# Altium schematic sheet 13_RFFE.SchDoc: RF front end
size A3; Organization: Lime Microsystems; Address1: Surrey Tech Centre; Address2: Guildford GU2 7YG; Address3: Surrey; Address4: United Kingdom; SheetNumber: 13
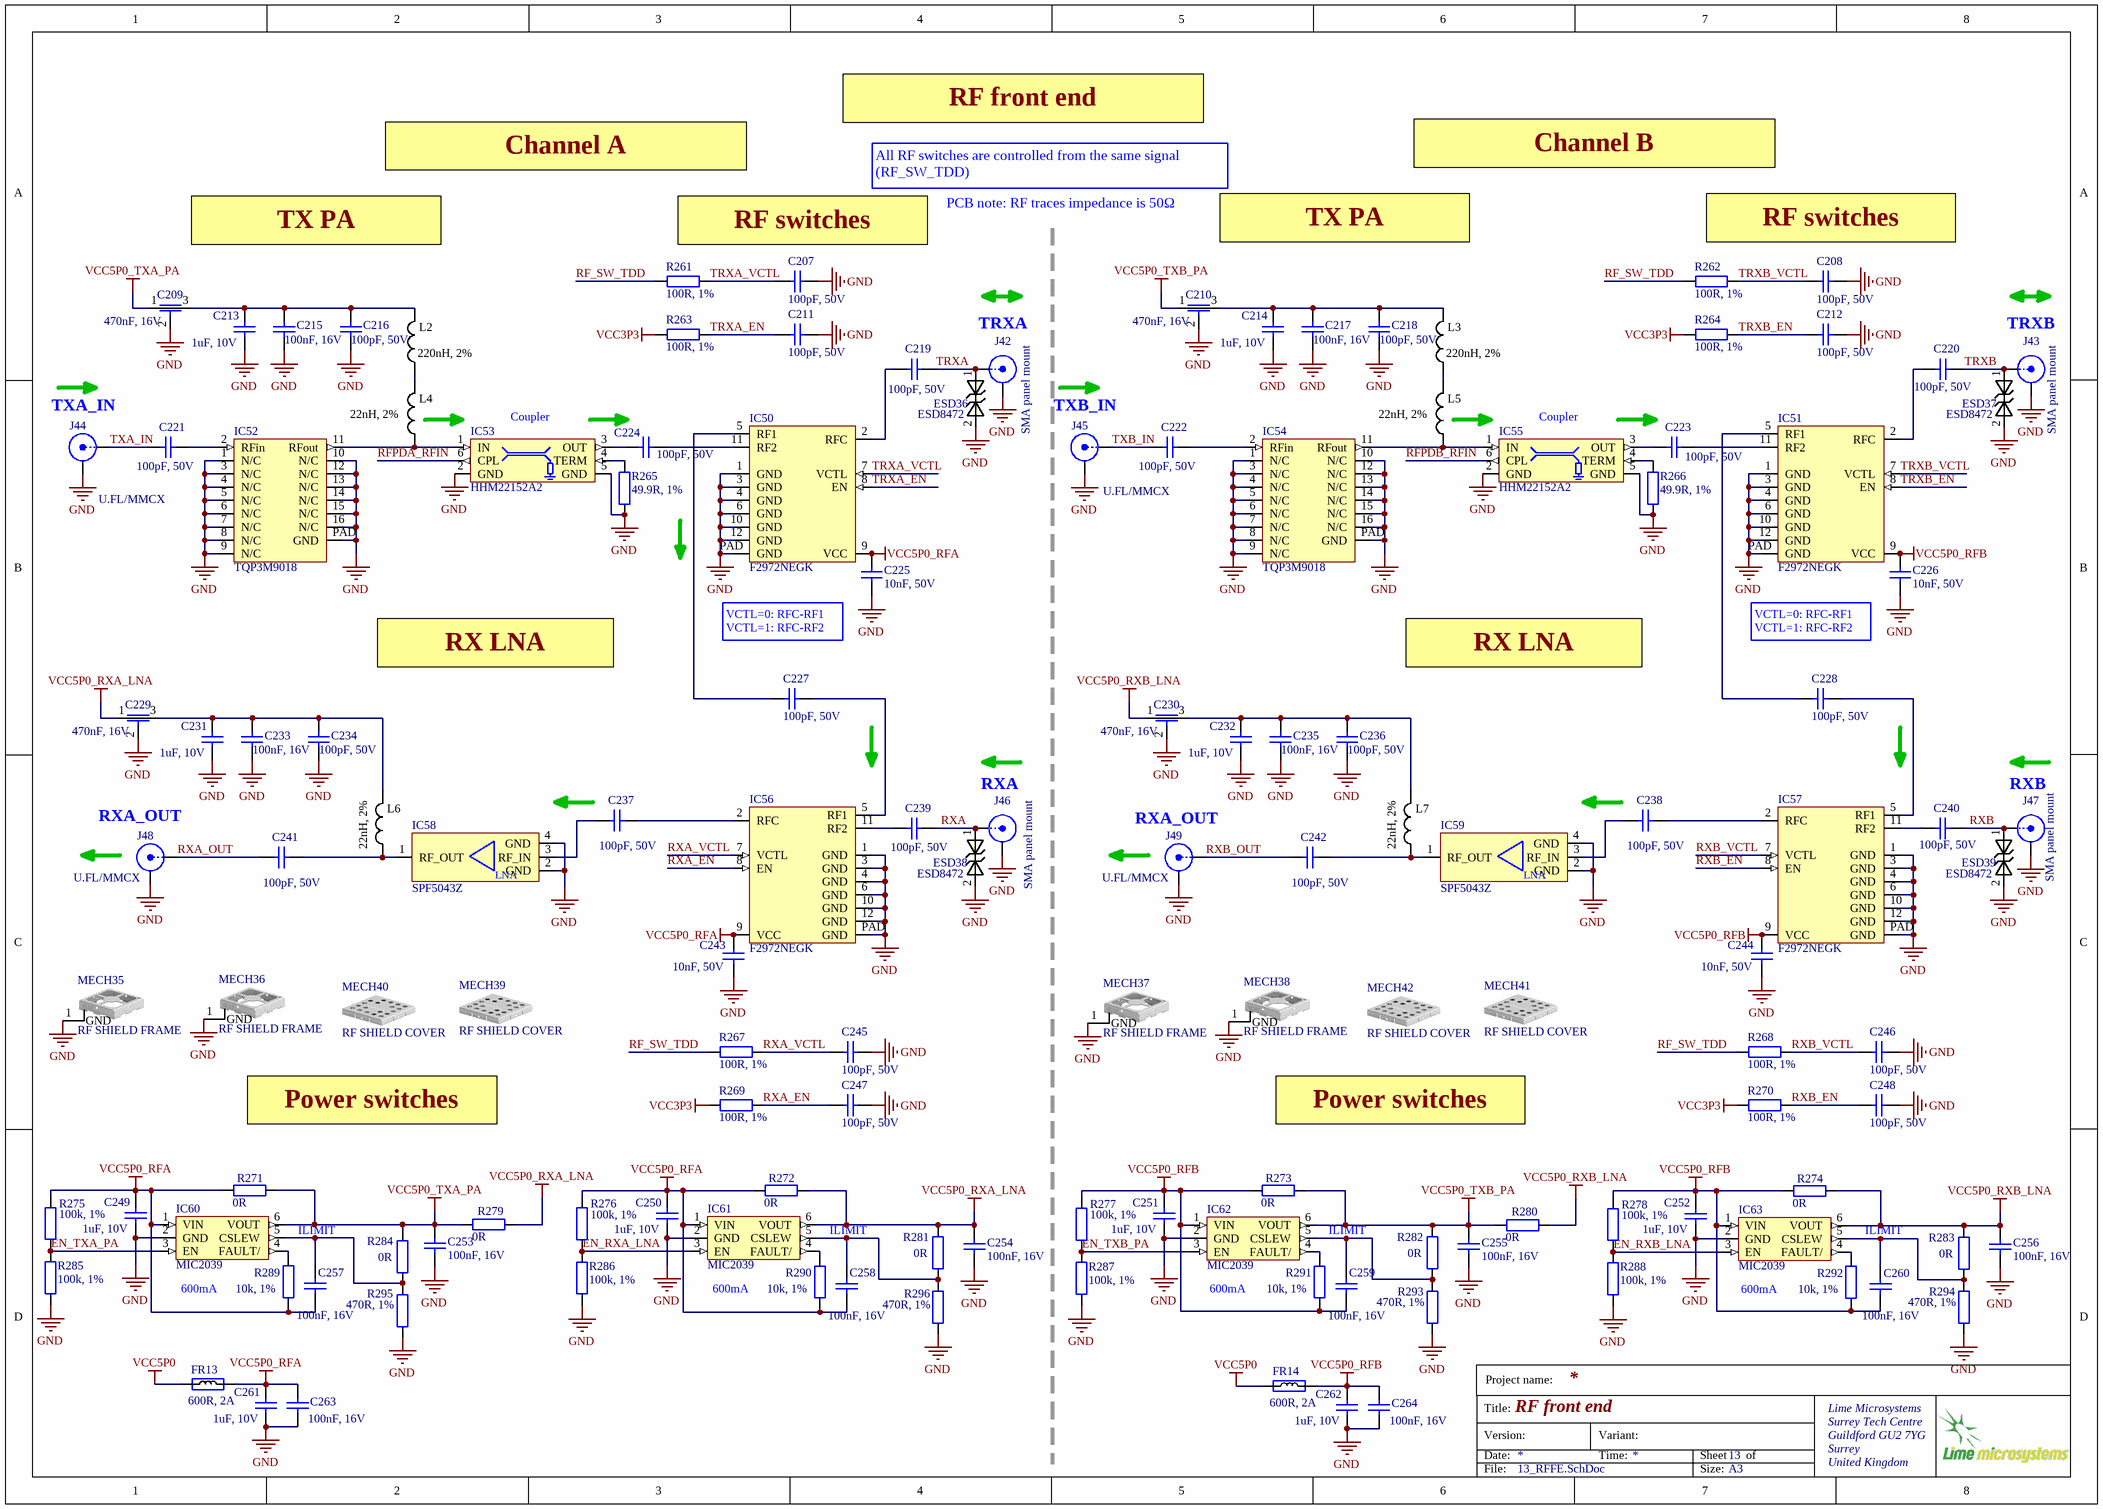
[diagram p0: 13_RFFE.SchDoc]

## Parts
C207  100pF, 50V  [CAP0402]
C208  100pF, 50V  [CAP0402]
C209  470nF, 16V  [CAP0805_FEEDTHROUGH]
C210  470nF, 16V  [CAP0805_FEEDTHROUGH]
C211  100pF, 50V  [CAP0402]
C212  100pF, 50V  [CAP0402]
C213  1uF, 10V  [CAP0402]
C214  1uF, 10V  [CAP0402]
C215  100nF, 16V  [CAP0402]
C216  100pF, 50V  [CAP0402]
C217  100nF, 16V  [CAP0402]
C218  100pF, 50V  [CAP0402]
C219  100pF, 50V  [CAP0402]
C220  100pF, 50V  [CAP0402]
C221  100pF, 50V  [CAP0402]
C222  100pF, 50V  [CAP0402]
C223  100pF, 50V  [CAP0402]
C224  100pF, 50V  [CAP0402]
C225  10nF, 50V  [CAP0402]
C226  10nF, 50V  [CAP0402]
C227  100pF, 50V  [CAP0402]
C228  100pF, 50V  [CAP0402]
C229  470nF, 16V  [CAP0805_FEEDTHROUGH]
C230  470nF, 16V  [CAP0805_FEEDTHROUGH]
C231  1uF, 10V  [CAP0402]
C232  1uF, 10V  [CAP0402]
C233  100nF, 16V  [CAP0402]
C234  100pF, 50V  [CAP0402]
C235  100nF, 16V  [CAP0402]
C236  100pF, 50V  [CAP0402]
C237  100pF, 50V  [CAP0402]
C238  100pF, 50V  [CAP0402]
C239  100pF, 50V  [CAP0402]
C240  100pF, 50V  [CAP0402]
C241  100pF, 50V  [CAP0402]
C242  100pF, 50V  [CAP0402]
C243  10nF, 50V  [CAP0402]
C244  10nF, 50V  [CAP0402]
C245  100pF, 50V  [CAP0402]
C246  100pF, 50V  [CAP0402]
C247  100pF, 50V  [CAP0402]
C248  100pF, 50V  [CAP0402]
C249  1uF, 10V  [CAP0402]
C250  1uF, 10V  [CAP0402]
C251  1uF, 10V  [CAP0402]
C252  1uF, 10V  [CAP0402]
C253  100nF, 16V  [CAP0402]
C254  100nF, 16V  [CAP0402]
C255  100nF, 16V  [CAP0402]
C256  100nF, 16V  [CAP0402]
C257  100nF, 16V  [CAP0402]
C258  100nF, 16V  [CAP0402]
C259  100nF, 16V  [CAP0402]
C260  100nF, 16V  [CAP0402]
C261  1uF, 10V  [CAP0402]
C262  1uF, 10V  [CAP0402]
C263  100nF, 16V  [CAP0402]
C264  100nF, 16V  [CAP0402]
ESD36  ESD8472  [ESD8472_X3DFN2]
ESD37  ESD8472  [ESD8472_X3DFN2]
ESD38  ESD8472  [ESD8472_X3DFN2]
ESD39  ESD8472  [ESD8472_X3DFN2]
FR13  600R, 2A  [RES0805]
FR14  600R, 2A  [RES0805]
IC50  F2972NEGK  [F2972NEGK_SPDT_RF_switch_12-TQFN]
IC51  F2972NEGK  [F2972NEGK_SPDT_RF_switch_12-TQFN]
IC52  TQP3M9018  [TQP3M9018_PA_QFN16]
IC53  HHM22152A2  [HHM22152A2_DIRECTIONAL_COUPLER]
IC54  TQP3M9018  [TQP3M9018_PA_QFN16]
IC55  HHM22152A2  [HHM22152A2_DIRECTIONAL_COUPLER]
IC56  F2972NEGK  [F2972NEGK_SPDT_RF_switch_12-TQFN]
IC57  F2972NEGK  [F2972NEGK_SPDT_RF_switch_12-TQFN]
IC58  SPF5043Z  [SPF5043Z_SOT-343]
IC59  SPF5043Z  [SPF5043Z_SOT-343]
IC60  MIC2039  [SOT23-6]
IC61  MIC2039  [SOT23-6]
IC62  MIC2039  [SOT23-6]
IC63  MIC2039  [SOT23-6]
J42  SMA panel mount  [SMA_connector_side]
J43  SMA panel mount  [SMA_connector_side]
J44  U.FL/MMCX  [MMCX_UFL_conn_u]
J45  U.FL/MMCX  [MMCX_UFL_conn_u]
J46  SMA panel mount  [SMA_connector_side]
J47  SMA panel mount  [SMA_connector_side]
J48  U.FL/MMCX  [MMCX_UFL_conn_u]
J49  U.FL/MMCX  [MMCX_UFL_conn_u]
L2  220nH, 2%  [RES0603]
L3  220nH, 2%  [RES0603]
L4  22nH, 2%  [RES0603]
L5  22nH, 2%  [RES0603]
L6  22nH, 2%  [RES0603]
L7  22nH, 2%  [RES0603]
MECH35  RF SHIELD FRAME  [RF_SHIELD_FRAME_16P5x16P5_2118716-2_v1]
MECH36  RF SHIELD FRAME  [RF_SHIELD_FRAME_16P5x16P5_2118716-2_v1]
MECH37  RF SHIELD FRAME  [RF_SHIELD_FRAME_16P5x16P5_2118716-2_v1]
MECH38  RF SHIELD FRAME  [RF_SHIELD_FRAME_16P5x16P5_2118716-2_v1]
MECH39  RF SHIELD COVER  [RF_SHIELD_COVER_16Px916P9_2118715-2]
MECH40  RF SHIELD COVER  [RF_SHIELD_COVER_16Px916P9_2118715-2]
MECH41  RF SHIELD COVER  [RF_SHIELD_COVER_16Px916P9_2118715-2]
MECH42  RF SHIELD COVER  [RF_SHIELD_COVER_16Px916P9_2118715-2]
R261  100R, 1%  [RES0402]
R262  100R, 1%  [RES0402]
R263  100R, 1%  [RES0402]
R264  100R, 1%  [RES0402]
R265  49.9R, 1%  [RES0402]
R266  49.9R, 1%  [RES0402]
R267  100R, 1%  [RES0402]
R268  100R, 1%  [RES0402]
R269  100R, 1%  [RES0402]
R270  100R, 1%  [RES0402]
R271  0R  [RES0402]
R272  0R  [RES0402]
R273  0R  [RES0402]
R274  0R  [RES0402]
R275  100k, 1%  [RES0402]
R276  100k, 1%  [RES0402]
R277  100k, 1%  [RES0402]
R278  100k, 1%  [RES0402]
R279  0R  [RES0805]
R280  0R  [RES0805]
R281  0R  [RES0402]
R282  0R  [RES0402]
R283  0R  [RES0402]
R284  0R  [RES0402]
R285  100k, 1%  [RES0402]
R286  100k, 1%  [RES0402]
R287  100k, 1%  [RES0402]
R288  100k, 1%  [RES0402]
R289  10k, 1%  [RES0402]
R290  10k, 1%  [RES0402]
R291  10k, 1%  [RES0402]
R292  10k, 1%  [RES0402]
R293  470R, 1%  [RES0402]
R294  470R, 1%  [RES0402]
R295  470R, 1%  [RES0402]
R296  470R, 1%  [RES0402]

## Nets
GND: C207.1 C208.1 C209.2 C210.2 C211.1 C212.1 C213.1 C214.1 C215.2 C216.1 C217.2 C218.1 C225.2 C226.2 C229.2 C230.2 C231.1 C232.1 C233.2 C234.1 C235.2 C236.1 C243.1 C244.1 C245.1 C246.1 C247.1 C248.1 C249.2 C250.2 C251.2 C252.2 C253.2 C254.2 C255.2 C256.2 C261.1 C262.1 C263.2 C264.2 ESD36.2 ESD37.2 ESD38.2 ESD39.2 IC50.1(GND) IC50.3(GND) IC50.4(GND) IC50.6(GND) IC50.10(GND) IC50.12(GND) IC50.PAD(GND) IC51.1(GND) IC51.3(GND) IC51.4(GND) IC51.6(GND) IC51.10(GND) IC51.12(GND) IC51.PAD(GND) IC52.1(N/C) IC52.3(N/C) IC52.4(N/C) IC52.5(N/C) IC52.6(N/C) IC52.7(N/C) IC52.8(N/C) IC52.9(N/C) IC52.10(N/C) IC52.12(N/C) IC52.13(N/C) IC52.14(N/C) IC52.15(N/C) IC52.16(N/C) IC52.PAD(GND) IC53.2(GND) IC53.5(GND) IC54.1(N/C) IC54.3(N/C) IC54.4(N/C) IC54.5(N/C) IC54.6(N/C) IC54.7(N/C) IC54.8(N/C) IC54.9(N/C) IC54.10(N/C) IC54.12(N/C) IC54.13(N/C) IC54.14(N/C) IC54.15(N/C) IC54.16(N/C) IC54.PAD(GND) IC55.2(GND) IC55.5(GND) IC56.1(GND) IC56.3(GND) IC56.4(GND) IC56.6(GND) IC56.10(GND) IC56.12(GND) IC56.PAD(GND) IC57.1(GND) IC57.3(GND) IC57.4(GND) IC57.6(GND) IC57.10(GND) IC57.12(GND) IC57.PAD(GND) IC58.2(GND) IC58.4(GND) IC59.2(GND) IC59.4(GND) IC60.2(GND) IC61.2(GND) IC62.2(GND) IC63.2(GND) J42.2(Y) J43.2(Y) J44.2(Y) J45.2(Y) J46.2(Y) J47.2(Y) J48.2(Y) J49.2(Y) MECH35.1(GND) MECH36.1(GND) MECH37.1(GND) MECH38.1(GND) R265.1 R266.1 R285.2 R286.2 R287.2 R288.2 R293.1 R294.1 R295.1 R296.1
VCC3P3: R263.2 R264.2 R269.2 R270.2
VCC5P0: FR13.1 FR14.1
VCC5P0_RFA: C225.1 C243.2 C249.1 C250.1 C257.2 C258.2 C261.2 C263.1 FR13.2 IC50.9(VCC) IC56.9(VCC) IC60.1(VIN) IC61.1(VIN) R271.2 R272.2 R275.1 R276.1 R289.1 R290.1
VCC5P0_RFB: C226.1 C244.2 C251.1 C252.1 C259.2 C260.2 C262.2 C264.1 FR14.2 IC51.9(VCC) IC57.9(VCC) IC62.1(VIN) IC63.1(VIN) R273.2 R274.2 R277.1 R278.1 R291.1 R292.1
VCC5P0_RXA_LNA: C229.1 C254.1 IC61.6(VOUT) R272.1 R279.1 R281.2
VCC5P0_RXB_LNA: C230.1 C256.1 IC63.6(VOUT) R274.1 R280.1 R283.2
VCC5P0_TXA_PA: C209.1 C253.1 IC60.6(VOUT) R271.1 R279.2 R284.2
VCC5P0_TXB_PA: C210.1 C255.1 IC62.6(VOUT) R273.1 R280.2 R282.2
EN_RXA_LNA: IC61.3(EN) R276.2 R286.1
EN_RXB_LNA: IC63.3(EN) R278.2 R288.1
EN_TXA_PA: IC60.3(EN) R275.2 R285.1
EN_TXB_PA: IC62.3(EN) R277.2 R287.1
RF_SW_TDD: R261.2 R262.2 R267.2 R268.2
RFPDA_RFIN: IC53.6(CPL)
RFPDB_RFIN: IC55.6(CPL)
RXA: C239.1 ESD38.1 J46.1(X)
RXA_EN: C247.2 IC56.8(EN) R269.1
RXA_OUT: C241.2 J48.1(X)
RXA_VCTL: C245.2 IC56.7(VCTL) R267.1
RXB: C240.1 ESD39.1 J47.1(X)
RXB_EN: C248.2 IC57.8(EN) R270.1
RXB_OUT: C242.2 J49.1(X)
RXB_VCTL: C246.2 IC57.7(VCTL) R268.1
TRXA: C219.1 ESD36.1 J42.1(X)
TRXA_EN: C211.2 IC50.8(EN) R263.1
TRXA_VCTL: C207.2 IC50.7(VCTL) R261.1
TRXB: C220.1 ESD37.1 J43.1(X)
TRXB_EN: C212.2 IC51.8(EN) R264.1
TRXB_VCTL: C208.2 IC51.7(VCTL) R262.1
TXA_IN: C221.2 J44.1(X)
TXB_IN: C222.2 J45.1(X)
NetC209_3: C209.3 C213.2 C215.1 C216.2 L2.1
NetC210_3: C210.3 C214.2 C217.1 C218.2 L3.1
NetC219_2: C219.2 IC50.2(RFC)
NetC220_2: C220.2 IC51.2(RFC)
NetC221_1: C221.1 IC52.2(RFin)
NetC222_1: C222.1 IC54.2(RFin)
NetC223_1: C223.1 IC51.11(RF2)
NetC223_2: C223.2 IC55.3(OUT)
NetC224_1: C224.1 IC50.11(RF2)
NetC224_2: C224.2 IC53.3(OUT)
NetC227_1: C227.1 IC56.5(RF1)
NetC227_2: C227.2 IC50.5(RF1)
NetC228_1: C228.1 IC57.5(RF1)
NetC228_2: C228.2 IC51.5(RF1)
NetC229_3: C229.3 C231.2 C233.1 C234.2 L6.1
NetC230_3: C230.3 C232.2 C235.1 C236.2 L7.1
NetC237_1: C237.1 IC56.2(RFC)
NetC237_2: C237.2 IC58.3(RF_IN)
NetC238_1: C238.1 IC57.2(RFC)
NetC238_2: C238.2 IC59.3(RF_IN)
NetC239_2: C239.2 IC56.11(RF2)
NetC240_2: C240.2 IC57.11(RF2)
NetC241_1: C241.1 IC58.1(RF_OUT) L6.2
NetC242_1: C242.1 IC59.1(RF_OUT) L7.2
NetC257_1: C257.1 IC60.5(CSLEW) R284.1 R295.2
NetC258_1: C258.1 IC61.5(CSLEW) R281.1 R296.2
NetC259_1: C259.1 IC62.5(CSLEW) R282.1 R293.2
NetC260_1: C260.1 IC63.5(CSLEW) R283.1 R294.2
NetIC52_11: IC52.11(RFout) IC53.1(IN) L4.2
NetIC53_4: IC53.4(TERM) R265.2
NetIC54_11: IC54.11(RFout) IC55.1(IN) L5.2
NetIC55_4: IC55.4(TERM) R266.2
NetIC60_4: IC60.4(FAULT/) R289.2
NetIC61_4: IC61.4(FAULT/) R290.2
NetIC62_4: IC62.4(FAULT/) R291.2
NetIC63_4: IC63.4(FAULT/) R292.2
NetL2_2: L2.2 L4.1
NetL3_2: L3.2 L5.1

## Notes on the sheet
- Channel A
- RF front end
- Channel B
- TX PA
- RF switches
- All RF switches are controlled from the same signal (RF_SW_TDD)
- PCB note: RF traces impedance is 50Ω
- TRXA
- TRXB
- (near J44) TXA_IN
- (near IC53) Coupler
- (near J45) TXB_IN
- (near IC55) Coupler
- VCTL=0: RFC-RF1
  VCTL=1: RFC-RF2
- RX LNA
- RXA
- RXB
- (near J48) RXA_OUT
- (near J49) RXA_OUT
- Power switches
- ILIMIT
- (near IC60) 600mA
- (near IC61) 600mA
- (near IC62) 600mA
- (near IC63) 600mA
- Project name:
- Title:
- Version:
- Date:
- Variant:
- Time:
- Sheet
- of
- File:
- Size:
- A3
- (in symbol SPF5043Z_RF_LNA) LNA

## Library data of the parts
C207 C208 C211 C212 C216 C218-C224 C227 C228 C234 C236-C242 C245-C248 = Cap_0402: Manufacturer Part Number 1: CC0402JRNPO9BN101; Manufacturer: Yageo; Part Description: 100pF ±5% 50V C0G, NP0 Ceramic Capacitor -55°C ~ 125°C Surface Mount, MLCC 0402 (1005 Metric) 0.039" L x 0.020" W (1.00mm x 0.50mm); Tolerance: ±5%; Temperature Coefficient: C0G, NP0; Value: 100pF, 50V; Capacitance: 100pF; Thickness (Max): 0.022" (0.55mm); Size / Dimension: 0.039" L x 0.020" W (1.00mm x 0.50mm); RoHS: RoHS Compliant; Ratings: -; Package / Case: 0402 (1005 Metric); Mounting Type: Surface Mount, MLCC; Height - Seated (Max): -; Features: -; Lead Spacing: -; Voltage - Rated: 50V; Operating Temperature: -55°C ~ 125°C; Packaging: Cut Tape (CT); Applications: General Purpose; Lead Style: -; Supplier 1: Digi-Key; Category: Capacitors; Supplier Part Number 1: 311-1024-1-ND
C209 C210 C229 C230 = Cap_feed_through: Part Description: 0.47µF Feed Through Capacitor 16V 2A 30mOhm 0805 (2012 Metric), 3 PC Pad; Manufacturer: Murata; Manufacturer Part Number 1: NFM21PC474R1C3D; Max Current Rating: 2A; Tolerance: 20%; DC Resistance (DCR): 30mR; Insulation Resistance: 1GR; Value: 470nF, 16V; Supplier 1: Digi-Key; Supplier Part Number 1: 490-2537-1-ND; Stock 1: 220606; Pricing 1: 1=0,25000, 10=0,22900, 25=0,21840, 50=0,21160, 100=0,20450, 250=0,19392, 500=0,16218, 1000=0,12586 (USD); Mount: Surface Mount,PCB; Case/Package: 0805; Weight: 0.000194oz; Case Code (Metric): 2012; Case Code (Imperial): 0805; Min Operating Temperature: -55°C; Max Operating Temperature: 125°C; Package Quantity: 1; Capacitance: 470nF; Packaging: Tape and Reel; Max Voltage Rating (DC): 16V; Current Rating: 2A; Voltage Rating: 16V; Voltage Rating (DC): 16V; Voltage: 16V; Current: 2A; Termination: Flat; Length: 2mm; Height: 0.85mm; Width: 1.25mm; Depth: 1.25mm; Radiation Hardening: No; REACH SVHC: No SVHC; Lead Free: Lead Free; RoHS: Yes
C213 C214 C231 C232 C261 C262 = Cap_0402: CAP CER 1UF 10V X5R 0402; Manufacturer: Yageo; Part Description: 1µF 10V Ceramic Capacitor X5R 0402 (1005 Metric) 0.039" L x 0.020" W (1.00mm x 0.50mm); Manufacturer Part Number 1: CC0402MRX5R6BB105; Notification: Current market demand for these product types have resulted in fluctuating and extending lead times. Lead times may differ.; Tolerance: ±20%; Value: 1uF, 10V; Supplier 1: Digi-Key; Supplier Part Number 1: 311-1732-1-ND; RoHS: RoHS Compliant; Applications: General Purpose; Category: Capacitors; ComponentLink1Description: http://www.yageo.com/documents/recent/UPY-GPHC_X5R_4V-to-50V_25.pdf; ComponentLink1URL: http://www.yageo.com/documents/recent/UPY-GPHC_X5R_4V-to-50V_25.pdf; Failure Rate: -; Features: -; Height - Seated (Max): -; Lead Spacing: -; Lead Style: -; Mounting Type: Surface Mount, MLCC; Operating Temperature: -55°C ~ 85°C; Package / Case: 0402 (1005 Metric); Packaging: Cut Tape (CT); Part Status: Active; Pricing 1: 1=0.22, 10=0.156, 100=0.0732, 500=0.0513, 1000=0.04248, 2500=0.03953, 5000=0.03617 (USD); Ratings: -; Size / Dimension: 0.039" L x 0.020" W (1.00mm x 0.50mm); Stock 1: 69600; Temperature Coefficient: X5R; Thickness (Max): 0.022" (0.55mm); Voltage - Rated: 10V
C215 C217 C233 C235 C253-C260 = Cap_0402: Manufacturer: Murata Electronics; Manufacturer Part Number 1: GRM155R71C104KA88D; Part Description: 0.10µF ±10% 16V Ceramic Capacitor X7R 0402 (1005 Metric); Tolerance: 10 %; Type: General Purpose MLCC; Capacitance: 0.1 uF; Case Length: 1 mm; Dielectric: X7R; Case Height: 0.5 mm; Temperature Coefficient / Code: +/- 15 %; Value: 100nF, 16V; Supplier 1: Mouser; Supplier Part Number 1: 81-GRM155R71C104KA88; Case Code - in: 0402; RoHS: RoHS Compliant; Operating Temperature Range: - 55 C to + 125 C; Series: GRM; Termination Style: SMD/SMT; Package / Case: 0402 (1005 metric); Voltage Rating DC: 16 V; Maximum Operating Temperature: + 125 C; Case Code - mm: 1005; Minimum Operating Temperature: - 55 C; Product Category: Low & Medium Capacitance SMD Ceramic Chip Capacitors; Packaging: Reel; Product: General Type MLCCs; Category: Multilayer Ceramic Capacitors MLCC - SMD/SMT; Brand: Murata Electronics; Case Width: 0.5 mm; RoHS - Mouser: Y; Standard Pack Qty: 10000; Minimum Order Quantity: 1; Reeling: True; Manufacturer Part Number: GRM155R71C104KA88D
C225 C226 C243 C244 = Cap_0402: Part Description: 10000pF ±10% 50V Ceramic Capacitor X7R 0402 (1005 Metric); Manufacturer: Murata Electronics North America; Manufacturer Part Number 1: GRM155R71H103KA88D; Tolerance: ±10%; Temperature Coefficient: X7R; Value: 10nF, 50V; Supplier 1: Digi-Key; Supplier Part Number 1: 490-4516-2-ND; RoHS: RoHS Compliant; Category: Capacitors; Stock 1: 10970000; Pricing 1: 10000=0.00185, 20000=0.00176, 30000=0.00167 (USD); Packaging: Tape & Reel (TR); Part Status: Active; Voltage - Rated: 50V; Operating Temperature: -55°C ~ 125°C; Features: -; Ratings: -; Applications: General Purpose; Mounting Type: Surface Mount, MLCC; Package / Case: 0402 (1005 Metric); Size / Dimension: 0.039" L x 0.020" W (1.00mm x 0.50mm); Height - Seated (Max): -; Thickness (Max): 0.022" (0.55mm); Lead Spacing: -; Lead Style: -; ComponentLink1URL: http://www.murata.com/~/media/webrenewal/support/library/catalog/products/capacitor/mlcc/c02e.ashx?la=en-us; ComponentLink1Description: http://www.murata.com/~/media/webrenewal/support/library/catalog/products/capacitor/mlcc/c02e.ashx?la=en-us
C249-C252 = Cap_0402: Manufacturer Part Number 1: CC0402MRX5R6BB105; Manufacturer: Yageo; Part Description: 1µF 10V Ceramic Capacitor X5R 0402 (1005 Metric) 0.039" L x 0.020" W (1.00mm x 0.50mm); Voltage Rating: 10; Capacitance Tolerance: ± 10%; Product Range: TDK - C Series; Ceramic Capacitor Case: 0402 [1005 Metric]; Capacitance: 1; Dielectric Characteristic: X6; Value: 1uF, 10V; Supplier 1: Digi-Key; Supplier Part Number 1: 311-1732-1-ND; MSL: -; RoHS: YES
C263 C264 = Cap_0603: Manufacturer Part Number 1: GRM155R71C104KA88D; Part Description: 0.10µF ±10% 16V Ceramic Capacitor X7R 0402 (1005 Metric); Brand: Murata Electronics; Tolerance: 10 %; Type: General Purpose MLCC; Capacitance: 0.1 uF; Temperature Coefficient / Code: +/- 15 %; Case Height: 0.5 mm; Case Length: 1 mm; Dielectric: X7R; Supplier 1: Mouser; Supplier Part Number 1: 81-GRM155R71C104KA88; Case Code - in: 0402; Manufacturer: Murata Electronics; Category: Multilayer Ceramic Capacitors MLCC - SMD/SMT; Voltage Rating DC: 16 V; Value: 100nF, 16V; Manufacturer Part Number: GRM155R71C104KA88D; Case Code - mm: 1005; Case Width: 0.5 mm; Maximum Operating Temperature: + 125 C; Minimum Operating Temperature: - 55 C; Minimum Order Quantity: 1; Operating Temperature Range: - 55 C to + 125 C; Package / Case: 0402 (1005 metric); Packaging: Reel; Product: General Type MLCCs; Product Category: Low & Medium Capacitance SMD Ceramic Chip Capacitors; Reeling: True; RoHS - Mouser: Y; RoHS: RoHS Compliant; Series: GRM; Standard Pack Qty: 10000; Termination Style: SMD/SMT
ESD36-ESD39 = ESD8472: Manufacturer: ON Semiconductor; Manufacturer Part Number 1: ESD8472MUT5G; Part Description: TVS DIODE 5.3VWM 14VC X3DFN2; Voltage - Reverse Standoff (Typ): 5.3V (Max); Voltage - Breakdown (Min): 7V; Voltage - Clamping (Max) @ Ipp: 14V; Current - Peak Pulse (10/1000µs): 3A (8/20µs); Power Line Protection: No; Capacitance @ Frequency: 0.2pF @ 1MHz; Supplier 1: Digi-Key; RoHS: RoHS Compliant; Category: Circuit Protection; Stock 1: 2295; Pricing 1: 1=0.39, 10=0.315, 100=0.2142, 500=0.16068, 1000=0.12051 (USD); Packaging: Cut Tape (CT); Part Status: Active; Type: Zener; Power - Peak Pulse: -; Applications: Automotive, RF Antenna; Operating Temperature: -55°C ~ 150°C (TJ); Mounting Type: Surface Mount; Package / Case: 2-XFDFN; Supplier Device Package: 2-X3DFN (0.62x0.32); ComponentLink1URL: http://www.onsemi.com/pub/Collateral/ESD8472-D.PDF; ComponentLink1Description: http://www.onsemi.com/pub/Collateral/ESD8472-D.PDF; Supplier Part Number 1: ESD8472MUT5GOSCT-ND
FR13 FR14 = Ferrite: Manufacturer Part Number 1: MPZ2012S601AT000; Manufacturer: TDK Corporation; Part Description: FERRITE BEAD 600 OHM 0805 1LN; Filter Type: Differential Mode - Single; Impedance @ Frequency: 600 Ohm @ 100MHz; DC Resistance (DCR): 100 mOhm Max; Supplier 1: Digi-Key; Supplier Part Number 1: 445-2206-2-ND; Mounting Type: Surface Mount; RoHS: RoHS Compliant; Height (Max): 0.041" (1.05mm); Packaging: Tape & Reel (TR); Category: Filters; Current Rating: 2A; Package / Case: 0805 (2012 Metric); Size / Dimension: 0.079" L x 0.049" W (2.00mm x 1.25mm); Value: 600R, 2A
IC50 IC51 IC56 IC57 = F2972NEGK_SPDT_RF_switch: Part Description: RF Switch IC General Purpose SPDT 50Ohm 12-VFQFPN (2x2); Manufacturer: Renesas; Insertion Loss: 0.23dB; Impedance: 75R; RF/Microwave Device Type: SPDT; Operating Supply Current: 80uA; Pitch: 500um; Supplier 1: Digikey; Supplier Part Number 1: 800-3764-ND; Manufacturer Part Number 1: F2972NEGK; Stock 1: 1955; Pricing 1: 1=2,62, 10=2,257, 25=2,1316, 100=1,9596, 250=1,8564, 500=1,78342 (USD); RoHS: Yes; Mount: Surface Mount; Number of Pins: 12; Terminal Finish: Tin; Max Operating Temperature: 105°C; Packaging: Cut Tape; JESD-609 Code: e3; Package Quantity: 3000; Length: 2mm; Width: 2mm; Height: 0.55mm; Thickness: 500um; RoHS Compliant: Yes; Lead Free: Lead Free; Reach SVHC Compliant: Yes; ComponentLink1URL: https://datasheet.ciiva.com/pdfs/VipMasterIC/IC/RNCC/RNCC-S-A0012905098/RNCC-S-A0013316118-1.pdf?src-supplier=IHS+Markit; ComponentLink1Description: https://datasheet.ciiva.com/pdfs/VipMasterIC/IC/RNCC/RNCC-S-A0012905098/RNCC-S-A0013316118-1.pdf?src-supplier=IHS+Markit; ComponentLink2URL: https://www.idt.com/document/dst/f2972-datasheet?src-supplier=Digikey; ComponentLink2Description: https://www.idt.com/document/dst/f2972-datasheet?src-supplier=Digikey
IC52 IC54 = TQP3M9018_PA: Part Description: RF Amplifier .05-4GHz P1dB= 22dB Gain 26.4dB 5Volts; Manufacturer: Qorvo; Manufacturer Part Number 1: TQP3M9019; Supplier 1: Mouser; Supplier Part Number 1: 772-TQP3M9019; Stock 1: 6804; Pricing 1: 1=7,48, 10=7,48, 50=5,43, 100=4,41, 1000=2,44, 10000=2,35 (USD); RoHS: Yes
IC53 IC55 = HHM22152A2_coupler: Part Description: RF Directional Coupler General Purpose 3W 0603 (1608 Metric), 6 PC Pad; Manufacturer: TDK; Insertion Loss: 0.4dB; Max Power Dissipation: 3W; Return Loss: 15dB; Supplier 1: Digikey; Supplier Part Number 1: 445-175379-1-ND; Manufacturer Part Number 1: HHM22152A2; Stock 1: 18287; Pricing 1: 1=0,22, 10=0,192, 25=0,1804, 100=0,1648, 250=0,15532, 500=0,14864, 1000=0,14231 (USD); RoHS: Yes; Case/Package: 1608; Case Code (Imperial): 0603; Case Code (Metric): 1608; Series: HHM; Packaging: Cut Tape
IC58 IC59 = SPF5043Z_RF_LNA: Part Description: RF Amplifier .05-4GHz SSG 12.9dB NF .8dB GaAs; Manufacturer: Qorvo; Supplier 1: Mouser; Supplier Part Number 1: 772-SPF5043Z; Manufacturer Part Number 1: SPF5043Z; Stock 1: 151851; Pricing 1: 1=3,68000, 10=3,68000, 50=2,67000, 100=2,17000, 1000=1,20000, 10000=1,06000 (USD); RoHS: Yes; RoHS Compliant: Yes
IC60-IC63 = MIC2033_power_switch: Part Description: Power Switch/Driver 1:1 P-Channel 2.5A SOT-23-6; Manufacturer: Microchip; Manufacturer Part Number 1: MIC2039EYM6-TR; Number of Outputs: 1; Interface: On/Off; Max Output Current: 2.5A; Fault Protection: Over Temperature; Output Configuration: High Side; ComponentLink1URL: http://www.mouser.com/ds/2/268/mic2033-b-1076865.pdf?src-supplier=Mouser; ComponentLink1Description: http://www.mouser.com/ds/2/268/mic2033-b-1076865.pdf?src-supplier=Mouser; ComponentLink2URL: http://components.arrow.com/part/dataview/56727820S413982N1374?src-supplier=Arrow+Electronics; ComponentLink2Description: http://components.arrow.com/part/dataview/56727820S413982N1374?src-supplier=Arrow+Electronics; ComponentLink3URL: http://www.microchip.com/mymicrochip/filehandler.aspx?ddocname=en579457&src-supplier=Digi-Key; ComponentLink3Description: http://www.microchip.com/mymicrochip/filehandler.aspx?ddocname=en579457&src-supplier=Digi-Key; Supplier 1: Digi-Key; Supplier Part Number 1: 576-4193-1-ND; Stock 1: 37195; Pricing 1: 1=0,98000, 25=0,80560, 100=0,75000 (USD); RoHS: No; Case/Package: SOT-23-6; Min Operating Temperature: -40°C; Max Operating Temperature: 125°C; Package Quantity: 3000; Packaging: Tape and Reel; Series: -; ComponentLink4URL: https://datasheet.ciiva.com/6607/mic2039-6607725.pdf?src-supplier=Digi-Key; ComponentLink4Description: https://datasheet.ciiva.com/6607/mic2039-6607725.pdf?src-supplier=Digi-Key
J42 J43 J46 J47 = RF_IF_connector: CONN SMA JACK STR 50OHM EDGE MNT; Manufacturer: Linx; Manufacturer Part Number 1: CONSMA002-L-G; Part Description: SMA Connector Receptacle, Female Socket 50Ohm Panel Mount, Through Hole, Right Angle Solder; Supplier 1: Digi-Key; Supplier Part Number 1: CONSMA002-L-G-ND; Stock 1: 815; Pricing 1: 1=4.08, 25=3.67, 100=3.32, 250=3.25, 500=3, 1000=2.80001, 2000=2.5875 (USD)
J44 J45 J48 J49 = RF_IF_connector: CONN UMC RCPT STR 50 OHM SMD; Manufacturer: Molex, LLC; Manufacturer Part Number 1: 0734120110; Body Finish: Nickel; Body Material: Phosphor Bronze; Center Contact Material: Brass; Center Contact Plating: Gold; Connector Style: Ultra Miniature Coaxial; Connector Type: Jack, Male Pin; Contact Termination: Solder; Dielectric Material: Liquid Crystal Polymer (LCP); Frequency - Max: 6GHz; Impedance: 50 Ohm; Voltage Rating: 60V; Cable Group: -; Category: Connectors, Interconnects; Fastening Type: Snap-On; Features: -; Housing Color: Silver; Ingress Protection: -; Mounting Type: Surface Mount; Operating Temperature: -40°C ~ 90°C; Packaging: Cut Tape (CT); RoHS: RoHS Compliant; Shield Termination: Solder; Supplier 1: Digi-Key; Supplier Part Number 1: WM5587CT-ND; Part Description: CONN UMC RCPT STR 50 OHM SMD
L2 L3 = Inductor: Part Description: 220 nH Unshielded Drum Core, Wirewound Inductor 280 mA 2.08Ohm Max 0603 (1608 Metric); Manufacturer: Murata; Manufacturer Part Number 1: LQW18ANR22G80D; Description: Ind Chip Unshielded Wirewound 220nH 2% 100MHz 25Q-Factor 280mA 0402 Paper T/R; Current Rating: 280mA; Shielding: Unshielded; Resistance: 2.08R; Self Resonant Frequency: 1.33GHz; Test Frequency: 100MHz; Value: 220nH, 2%; ComponentLink1URL: http://productfinder.pulseeng.com/products/datasheets/WC701.pdf; ComponentLink1Description: http://productfinder.pulseeng.com/products/datasheets/WC701.pdf; ComponentLink2URL: https://datasheet.ciiva.com/11799/0900766b80a002db-11799279.pdf?src-supplier=RSComponents; ComponentLink2Description: https://datasheet.ciiva.com/11799/0900766b80a002db-11799279.pdf?src-supplier=RSComponents; ComponentLink3URL: https://datasheet.ciiva.com/14124/qhlqw18a-data-e-14124619.pdf?src-supplier=Distrelec; ComponentLink3Description: https://datasheet.ciiva.com/14124/qhlqw18a-data-e-14124619.pdf?src-supplier=Distrelec; ComponentLink4URL: https://datasheet.ciiva.com/6705/l0075s0080lqw18a-00-6705627.pdf?src-supplier=Digi-Key; ComponentLink4Description: https://datasheet.ciiva.com/6705/l0075s0080lqw18a-00-6705627.pdf?src-supplier=Digi-Key; ComponentLink5URL: https://datasheet.ciiva.com/6705/l0075s0080lqw18a-00-6705626.pdf?src-supplier=Digi-Key; ComponentLink5Description: https://datasheet.ciiva.com/6705/l0075s0080lqw18a-00-6705626.pdf?src-supplier=Digi-Key; ComponentLink6URL: https://datasheet.ciiva.com/6705/l0075s0080lqw18a-00-6705631.pdf?src-supplier=Digi-Key; ComponentLink6Description: https://datasheet.ciiva.com/6705/l0075s0080lqw18a-00-6705631.pdf?src-supplier=Digi-Key; ComponentLink7URL: https://datasheet.ciiva.com/4977/product-4977173.pdf?src-supplier=Mouser; ComponentLink7Description: https://datasheet.ciiva.com/4977/product-4977173.pdf?src-supplier=Mouser; ComponentLink8URL: https://datasheet.ciiva.com/46391/1487239-46391853.pdf?src-supplier=Element14; ComponentLink8Description: https://datasheet.ciiva.com/46391/1487239-46391853.pdf?src-supplier=Element14; ComponentLink9URL: https://datasheet.ciiva.com/8507/l0075s0080lqw18a-00-8507496.pdf?src-supplier=Avnet; ComponentLink9Description: https://datasheet.ciiva.com/8507/l0075s0080lqw18a-00-8507496.pdf?src-supplier=Avnet; ComponentLink10URL: https://datasheet.ciiva.com/29698/inductor-commercial-decoupling-mlz-en-29698909.pdf?src-supplier=Digikey; ComponentLink10Description: https://datasheet.ciiva.com/29698/inductor-commercial-decoupling-mlz-en-29698909.pdf?src-supplier=Digikey; ComponentLink11URL: https://datasheet.ciiva.com/29698/inductor-commercial-decoupling-mlz-en-29698910.pdf?src-supplier=Digikey; ComponentLink11Description: https://datasheet.ciiva.com/29698/inductor-commercial-decoupling-mlz-en-29698910.pdf?src-supplier=Digikey; ComponentLink12URL: https://datasheet.ciiva.com/29698/inductor-commercial-decoupling-mlz-en-29698911.pdf?src-supplier=Digikey; ComponentLink12Description: https://datasheet.ciiva.com/29698/inductor-commercial-decoupling-mlz-en-29698911.pdf?src-supplier=Digikey; Supplier 1: Digikey; Supplier Part Number 1: 490-16902-1-ND; Stock 1: 2183; Pricing 1: 1=0.14, 10=0.117, 100=0.0961, 1000=0.07905, 4000=0.07027, 8000=0.06626, 12000=0.06402, 20000=0.06131, 28000=0.05959, 40000=0.05782, 100000=0.05352 (USD); RoHS: Yes; Mount: Surface Mount; Case/Package: 0603; Min Operating Temperature: -55°C; Max Operating Temperature: 125°C; Package Quantity: 4000; Packaging: Tape and Reel; Tolerance: 2%; Inductance: 220nH; DC Resistance (DCR): 2.08R; Series: LQW18A_80; Length: 0.065inch; Width: 0.035inch; Height - Seated (Max): 0.039inch; RoHS Compliant: Yes; ComponentLink13URL: https://datasheet.ciiva.com/29692/l0075e-29692111.pdf?src-supplier=Digikey; ComponentLink13Description: https://datasheet.ciiva.com/29692/l0075e-29692111.pdf?src-supplier=Digikey
L4-L7 = Inductor: Manufacturer: Murata; Manufacturer Part Number 1: LQW18AN22NG00D; Part Description: Fixed Inductors 22 NH 2%; Core Material: Non-Magnetic; Self Resonant Frequency: 4.6GHz; Shielding: Unshielded; Q Factor: 40; Current Rating: 500mA; DC Resistance (DCR): 170mR; Test Frequency: 100MHz; Current: 400mA; Value: 22nH, 2%; ComponentLink1URL: http://productfinder.pulseeng.com/products/datasheets/WC701.pdf; ComponentLink1Description: http://productfinder.pulseeng.com/products/datasheets/WC701.pdf; Parameter 1: *; Supplier 1: Digi-Key; Supplier Part Number 1: 490-6874-1-ND; Stock 1: 60315; Pricing 1: 1=0,18000, 10=0,16300, 25=0,14520, 50=0,12340, 100=0,10890, 250=0,09984, 500=0,09076, 1000=0,07623 (USD); RoHS: Yes; Mount: Surface Mount; Case/Package: 0603; Number of Pins: 2; Weight: 0.000106oz; Case Code (Metric): 1608; Case Code (Imperial): 0603; Min Operating Temperature: -55°C; Max Operating Temperature: 125°C; Tolerance: 2%; Inductance Tolerance: 2%; Packaging: Tape and Reel; Package Quantity: 4000; Inductance: 22nH; Max DC Current: 500mA; Termination: SMD/SMT; Resistor Type: Wirewound; DC Current: 500mA; Series Resistance: 170mR; Series: LQW18A_00; Rated Current-Max: 500mA; Length: 1.6mm; Width: 0.8mm; Height: 0.8mm; Height - Seated (Max): 0.039inch; Depth: 1mm; REACH SVHC: No SVHC; Military Standard: Not; Lead Free: Lead Free; RoHS Compliant: Yes; ComponentLink2URL: https://datasheet.ciiva.com/11799/0900766b80a002db-11799279.pdf?src-supplier=RSComponents; ComponentLink2Description: https://datasheet.ciiva.com/11799/0900766b80a002db-11799279.pdf?src-supplier=RSComponents; ComponentLink3URL: https://datasheet.ciiva.com/14124/qhlqw18a-data-e-14124619.pdf?src-supplier=Distrelec; ComponentLink3Description: https://datasheet.ciiva.com/14124/qhlqw18a-data-e-14124619.pdf?src-supplier=Distrelec; ComponentLink4URL: https://datasheet.ciiva.com/6705/l0075s0080lqw18a-00-6705627.pdf?src-supplier=Digi-Key; ComponentLink4Description: https://datasheet.ciiva.com/6705/l0075s0080lqw18a-00-6705627.pdf?src-supplier=Digi-Key; ComponentLink5URL: https://datasheet.ciiva.com/6705/l0075s0080lqw18a-00-6705626.pdf?src-supplier=Digi-Key; ComponentLink5Description: https://datasheet.ciiva.com/6705/l0075s0080lqw18a-00-6705626.pdf?src-supplier=Digi-Key; ComponentLink6URL: https://datasheet.ciiva.com/6705/l0075s0080lqw18a-00-6705631.pdf?src-supplier=Digi-Key; ComponentLink6Description: https://datasheet.ciiva.com/6705/l0075s0080lqw18a-00-6705631.pdf?src-supplier=Digi-Key; ComponentLink7URL: https://datasheet.ciiva.com/4977/product-4977173.pdf?src-supplier=Mouser; ComponentLink7Description: https://datasheet.ciiva.com/4977/product-4977173.pdf?src-supplier=Mouser; ComponentLink8URL: https://datasheet.ciiva.com/46391/1487239-46391853.pdf?src-supplier=Element14; ComponentLink8Description: https://datasheet.ciiva.com/46391/1487239-46391853.pdf?src-supplier=Element14; ComponentLink9URL: https://datasheet.ciiva.com/8507/l0075s0080lqw18a-00-8507496.pdf?src-supplier=Avnet; ComponentLink9Description: https://datasheet.ciiva.com/8507/l0075s0080lqw18a-00-8507496.pdf?src-supplier=Avnet
MECH35-MECH38 = RF_SHIELD_FRAME_16P5x16P5_2118716-2: Part Description: RF Shield Frame 0.650" (16.50mm) X 0.650" (16.50mm) Surface Mount; Manufacturer: TE Connectivity; Supplier 1: Digi-Key; Supplier Part Number 1: A126152CT-ND; Manufacturer Part Number 1: 2118716-2; Stock 1: 26553; Pricing 1: 1=0,93000, 10=0,81600, 25=0,76680, 100=0,62570, 250=0,58120 (USD); RoHS: Yes; ComponentLink1URL: https://www.te.com/commerce/DocumentDelivery/DDEController?Action=srchrtrv&DocNm=2118716&DocType=Customer+Drawing&DocLang=English&src-supplier=Digi-Key; ComponentLink1Description: https://www.te.com/commerce/DocumentDelivery/DDEController?Action=srchrtrv&DocNm=2118716&DocType=Customer+Drawing&DocLang=English&src-supplier=Digi-Key
MECH39-MECH42 = RF_SHIELD_COVER_16P9x16P9_2118715-2: Part Description: RF Shield Cover 0.665" (16.90mm) X 0.665" (16.90mm) Vented Surface Mount; Manufacturer: TE Connectivity; ComponentLink1URL: https://www.te.com/commerce/DocumentDelivery/DDEController?Action=srchrtrv&DocNm=2118716&DocType=Customer+Drawing&DocLang=English&src-supplier=Digi-Key; ComponentLink1Description: https://www.te.com/commerce/DocumentDelivery/DDEController?Action=srchrtrv&DocNm=2118716&DocType=Customer+Drawing&DocLang=English&src-supplier=Digi-Key; Supplier 1: Digi-Key; Supplier Part Number 1: A126120-ND; Manufacturer Part Number 1: 2118715-2; Stock 1: 58094; Pricing 1: 1=1,44000, 10=1,28900, 25=1,22400, 100=1,00530, 250=0,93972, 500=0,83046, 1000=0,65562, 2500=0,61191, 5000=0,58132 (USD); RoHS: Yes; ComponentLink2URL: https://www.te.com/commerce/DocumentDelivery/DDEController?Action=srchrtrv&DocNm=2118715&DocType=Customer+Drawing&DocLang=English&src-supplier=Digi-Key; ComponentLink2Description: https://www.te.com/commerce/DocumentDelivery/DDEController?Action=srchrtrv&DocNm=2118715&DocType=Customer+Drawing&DocLang=English&src-supplier=Digi-Key
R261-R264 R267-R270 = Res_0402: Manufacturer Part Number 1: RMCF0402FT100R; Manufacturer: Stackpole Electronics Inc.; Part Description: RES SMD 100 OHM 1% 1/16W 0402; Power (Watts): 0.063W, 1/16W; Temperature Coefficient: ±100ppm/°C; Resistance (Ohms): 100; Value: 100R, 1%; Supplier 1: Digi-Key; Supplier Part Number 1: RMCF0402FT100RDKR-ND; Packaging: Digi-Reel®; Composition: Thick Film; Number of Terminations: 2; Package / Case: 0402 (1005 Metric); RoHS: RoHS Compliant; Category: Resistors; Size / Dimension: 0.039" L x 0.020" W (1.00mm x 0.50mm); Tolerance: ±1%; Supplier Device Package: 0402; Features: -; Height: 0.016" (0.40mm); Operating Temperature: -55°C ~ 155°C
R265 R266 = Res_0402: Manufacturer: Samsung Electro-Mechanics America, Inc.; Part Description: RES SMD 49.9 OHM 1% 1/16W 0402; Manufacturer Part Number 1: RC1005F49R9CS; Temperature Coefficient: ±100ppm/°C; Resistance (Ohms): 49.9; Power (Watts): 0.063W, 1/16W; Number of Terminations: 2; Size / Dimension: 0.039" L x 0.020" W (1.00mm x 0.50mm); Supplier Device Package: 0402 (1005 Metric); RoHS: RoHS Compliant; Supplier Part Number 1: 1276-3469-6-ND; Features: -; Packaging: Digi-Reel®; Tolerance: ±1%; Height: 0.016" (0.40mm); Category: Resistors; Composition: Thick Film; Package / Case: 0402 (1005 Metric); Supplier 1: Digi-Key; Operating Temperature: -55°C ~ 155°C; Value: 49.9R, 1%
R271-R274 R281-R284 = Res_0402: Manufacturer Part Number 1: RC0402JR-070RL; Manufacturer: Yageo; Part Description: RES SMD 0.0OHM JUMPER 1/16W 0402; Resistance (Ohms): 0.0; Tolerance: Jumper; Power (Watts): 0.063W, 1/16W; Value: 0R; Supplier 1: Digi-Key; Supplier Part Number 1: 311-0.0JRTR-ND; Category: Resistors; Temperature Coefficient: -; Features: Moisture Resistant; Supplier Device Package: 0402; Height: 0.016" (0.40mm); Package / Case: 0402 (1005 Metric); Operating Temperature: -55°C ~ 155°C; Size / Dimension: 0.039" L x 0.020" W (1.00mm x 0.50mm); Composition: Thick Film; Packaging: Tape & Reel (TR); Number of Terminations: 2; RoHS: RoHS Compliant
R275-R278 R285-R288 = Res_0402: Part Description: 100 kOhms ±1% 0.063W, 1/16W Chip Resistor 0402 (1005 Metric) Thick Film; Manufacturer: Vishay; Manufacturer Part Number 1: CRCW0402100KFKEDC; Power Rating: 62.5mW; Resistance: 100kR; Temperature Coefficient: 100ppm/°C; Value: 100k, 1%; Supplier 1: Digi-Key; Supplier Part Number 1: 541-3960-6-ND; Stock 1: 702107; Pricing 1: 1=0,10000, 10=0,03300, 100=0,01360, 1000=0,00610, 2500=0,00529, 5000=0,00437 (USD); RoHS: Yes; Mount: Surface Mount; Case/Package: SMD/SMT; Contact Plating: Tin; Min Operating Temperature: -55°C; Max Operating Temperature: 155°C; Tolerance: 1%; Resistor Type: Thick Film; Termination: Wraparound; Length: 1mm; Lead Free: Lead Free; RoHS Compliant: Yes; ComponentLink1URL: http://www.vishay.com/docs/28773/crcwce3.pdf?src-supplier=Digi-Key; ComponentLink1Description: http://www.vishay.com/docs/28773/crcwce3.pdf?src-supplier=Digi-Key
R279 R280 = Res_0402: Manufacturer Part Number 1: CRCW08050000Z0EA; Manufacturer: Vishay Dale; Part Description: RES SMD 0.0 OHM JUMPER 1/8W 0805; Power (Watts): 0.125W, 1/8W; Resistance (Ohms): 0.0; Tolerance: Jumper; Value: 0R; Supplier 1: Digi-Key; Supplier Part Number 1: 541-0.0ATR-ND; Package / Case: 0805 (2012 Metric); Height: 0.020" (0.50mm); Packaging: Tape & Reel (TR); Operating Temperature: -55°C ~ 155°C; Temperature Coefficient: -; RoHS: RoHS Compliant; Size / Dimension: 0.079" L x 0.049" W (2.00mm x 1.25mm); Supplier Device Package: 0805 (2012 Metric); Number of Terminations: 2; Category: Resistors; Features: Automotive AEC-Q200; Composition: Thick Film
R289-R292 = Res_0402: Manufacturer: Yageo; Manufacturer Part Number 1: RC0402FR-0710KL; Part Description: RES SMD 10K OHM 1% 1/16W 0402; Temperature Coefficient: ±100ppm/°C; Power (Watts): 0.063W, 1/16W; Value: 10k, 1%; Supplier 1: Digi-Key; Supplier Part Number 1: 311-10.0KLRTR-ND; Resistance (Ohms): 10k; Packaging: Tape & Reel (TR); RoHS: RoHS Compliant; Package / Case: 0402 (1005 Metric); Tolerance: ±1%; Operating Temperature: -55°C ~ 155°C; Size / Dimension: 0.039" L x 0.020" W (1.00mm x 0.50mm); Number of Terminations: 2; Category: Resistors; Height: 0.016" (0.40mm); Supplier Device Package: 0402; Features: Moisture Resistant; Composition: Thick Film
R293-R296 = Res_0402: Manufacturer 1: Yageo; Manufacturer Part Number 1: RC0402FR-07470RL; Part Description: 470 Ohms ±1% 0.063W, 1/16W Chip Resistor 0402 (1005 Metric) Moisture Resistant Thick Film; Power Rating: 62.5mW; Temperature Coefficient: 100ppm/°C; Voltage Rating: 50V; Max Power Dissipation: 63mW; Value: 470R, 1%; Supplier 1: Digi-Key; Supplier Part Number 1: 311-470LRCT-ND; Stock 1: 1652476; Pricing 1: 1=0,10000, 10=0,01600, 100=0,00660, 1000=0,00299, 2500=0,00259, 5000=0,00214 (USD); RoHS: Yes; Case/Package: 0402; Case Code (Metric): 1005; Case Code (Imperial): 0402; Size Code: 0402; Min Operating Temperature: -55°C; Max Operating Temperature: 155°C; Packaging: Tape and Reel; Tolerance: 1%; Resistance: 470R; Number of Terminations: 2; Features: Moisture Resistant; Package Quantity: 1; Resistor Type: Thick Film; Termination: SMD/SMT; Series: RC; Resistance Tolerance: 1%; Construction: Rectangular; Length: 1mm; Width: 0.02inch; Height: 0.016inch; Depth: 0.5mm; Lead Free: Lead Free; REACH SVHC: Unknown; Military Standard: Not; RoHS Compliant: Yes; Manufacturer: Yageo